# EAGLE design 2015_Amother (EAGLE 6.2)
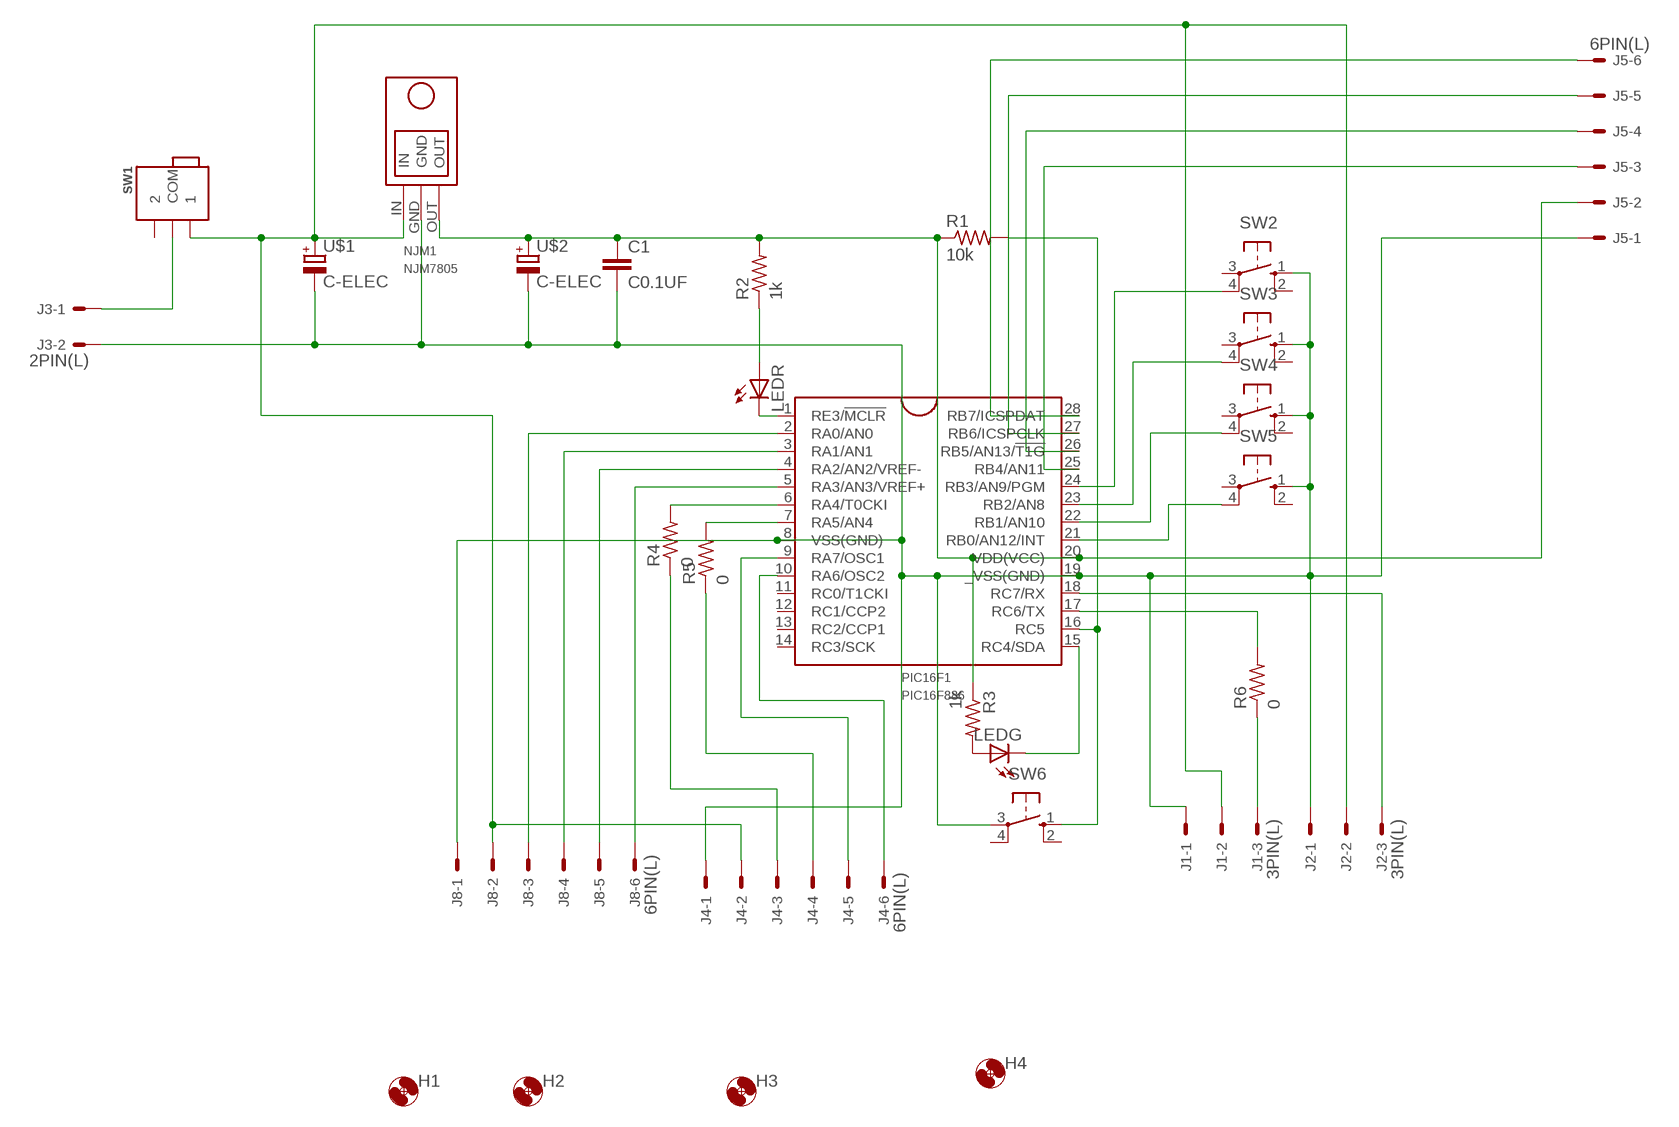
[diagram p0: schematic, sheet 1]

## Parts
C1  C0.1UF  [C0.1UF]
H1  HOLE3.3M3BOLT  [HOLE3.3]
H2  HOLE3.3M3BOLT  [HOLE3.3]
H3  HOLE3.3M3BOLT  [HOLE3.3]
H4  HOLE3.3M3BOLT  [HOLE3.3]
J1  3PIN(L)  [3PL]
J2  3PIN(L)  [3PL]
J3  2PIN(L)  [2PL]
J4  6PIN(L)  [6PL]
J5  6PIN(L)  [6PL]
J8  6PIN(L)  [6PL]
LEDG  LED3MM  [LED3MM]
LEDR  LED3MM  [LED3MM]
NJM1  NJM7805  [NJM7805]
PIC16F1  PIC16F886  [DIL28-3]
R1  10k  R-  [0207/10]
R2  1k  R-  [0207/10]
R3  1k  R-  [0207/10]
R4  0  R-  [0207/10]
R5  0  R-  [0207/10]
R6  0  R-  [0207/10]
SW1  SWITCH_MININORMAL  [SWITCH_MINI]
SW2  TACTSW  [TACT]
SW3  TACTSW  [TACT]
SW4  TACTSW  [TACT]
SW5  TACTSW  [TACT]
SW6  TACTSW  [TACT]
U$1  C-ELEC  [C-6MM]
U$2  C-ELEC  [C-6MM]

## Nets
N$1: J3.1 SW1.COM
N$2: J1.2 J2.2 J4.2 J8.2 NJM1.IN SW1.1 U$1.+
N$3: J4.3 R4.1
N$4: LEDG.A R3.2
N$5: PIC16F1.16(RC5) R1.2 SW6.1(S)
N$6: J1.3 R6.1
N$7: J8.3 PIC16F1.2(RA0/AN0)
N$8: J8.4 PIC16F1.3(RA1/AN1)
N$9: J8.5 PIC16F1.4(RA2/AN2/VREF-)
N$10: J8.6 PIC16F1.5(RA3/AN3/VREF+)
N$11: J4.4 R5.1
N$12: LEDR.A R2.1
N$13: C1.2 J1.1 J2.1 J3.2 J4.1 J5.1 J8.1 NJM1.GND PIC16F1.8(VSS(GND)) PIC16F1.19(_VSS(GND)) SW2.1(S) SW3.1(S) SW4.1(S) SW5.1(S) SW6.3(P) U$1.- U$2.-
N$14: LEDR.K(C) PIC16F1.1(RE3/!MCLR)
N$15: PIC16F1.21(RB0/AN12/INT) SW5.4(P1)
N$16: PIC16F1.22(RB1/AN10) SW4.4(P1)
N$17: J4.5 PIC16F1.9(RA7/OSC1)
N$18: PIC16F1.24(RB3/AN9/PGM) SW2.4(P1)
N$19: J4.6 PIC16F1.10(RA6/OSC2)
N$20: PIC16F1.23(RB2/AN8) SW3.4(P1)
N$21: LEDG.K(C) PIC16F1.15(RC4/SDA)
N$22: J5.3 PIC16F1.25(RB4/AN11)
N$23: C1.1 J5.2 NJM1.OUT PIC16F1.20(VDD(VCC)) R1.1 R2.2 R3.1 U$2.+
N$24: J5.4 PIC16F1.26(RB5/AN13/!T1G)
N$25: PIC16F1.17(RC6/TX) R6.2
N$26: J5.5 PIC16F1.27(RB6/ICSPCLK)
N$27: J5.6 PIC16F1.28(RB7/ICSPDAT)
N$28: PIC16F1.6(RA4/T0CKI) R4.2
N$29: PIC16F1.7(RA5/AN4) R5.2
N$30: J2.3 PIC16F1.18(RC7/RX)
Unconnected: PIC16F1.11(RC0/T1CKI) PIC16F1.12(RC1/CCP2) PIC16F1.13(RC2/CCP1) PIC16F1.14(RC3/SCK) SW1.2 SW2.2(S1) SW2.3(P) SW3.2(S1) SW3.3(P) SW4.2(S1) SW4.3(P) SW5.2(S1) SW5.3(P) SW6.2(S1) SW6.4(P1)

## Library data of the parts
C1 = FP-21T for MITS:C0.1UF
H1-H4 = FP-21T for MITS:HOLE3.3
J1 J2 = my_connector:3PIN(L)
J3 = my_connector:2PIN(L)
J4 J5 J8 = my_connector:6PIN(L)
LEDG LEDR = FP-21T for MITS:LED: LED OSRAM: - CHIPLED LG R971, LG N971, LY N971, LG Q971, LY Q971, LO R971, LY R971 LH N974, LH R974 LS Q976, LO Q976, LY Q976 LO Q996 - Hyper CHIPLED LW Q18S LB Q993, LB Q99A, LB R99A - SideLED LS A670, LO A670, LY A670, LG A670, LP A670 LB A673, LV A673, LT A673, LW A673 LH A674 LY A675 LS A676, LA A676, LO A676, LY A676, LW A676 LS A679, LY A679, LG A679 - Hyper Micro SIDELED® LS Y876, LA Y876, LO Y876, LY Y876 LT Y87S - SmartLED LW L88C, LW L88S LB L89C, LB L89S, LG L890 LS L89K, LO L89K, LY L89K LS L896, LA L896, LO L896, LY L896 - TOPLED LS T670, LO T670, LY T670, LG T670, LP T670 LSG T670, LSP T670, LSY T670, LOP T670, LYG T670 LG T671, LOG T671, LSG T671 LB T673, LV T673, LT T673, LW T673 LH T674 LS T676, LA T676, LO T676, LY T676, LB T676, LH T676, LSB T676, LW T676 LB T67C, LV T67C, LT T67C, LS T67K, LO T67K, LY T67K, LW E67C LS E67B, LA E67B, LO E67B, LY E67B, LB E67C, LV E67C, LT E67C LW T67C LS T679, LY T679, LG T679 LS T770, LO T770, LY T770, LG T770, LP T770 LB T773, LV T773, LT T773, LW T773 LH T774 LS E675, LA E675, LY E675, LS T675 LS T776, LA T776, LO T776, LY T776, LB T776 LHGB T686 LT T68C, LB T68C - Hyper Mini TOPLED® LB M676 - Mini TOPLED Santana® LG M470 LS M47K, LO M47K, LY M47K Source: http://www.osram.convergy.de - LUMILED® LXK2-PW12-R00, LXK2-PW12-S00, LXK2-PW14-U00, LXK2-PW14-V00 LXK2-PM12-R00, LXK2-PM12-S00, LXK2-PM14-U00 LXK2-PE12-Q00, LXK2-PE12-R00, LXK2-PE12-S00, LXK2-PE14-T00, LXK2-PE14-U00 LXK2-PB12-K00, LXK2-PB12-L00, LXK2-PB12-M00, LXK2-PB14-N00, LXK2-PB14-P00, LXK2-PB14-Q00 LXK2-PR12-L00, LXK2-PR12-M00, LXK2-PR14-Q00, LXK2-PR14-R00 LXK2-PD12-Q00, LXK2-PD12-R00, LXK2-PD12-S00 LXK2-PH12-R00, LXK2-PH12-S00 LXK2-PL12-P00, LXK2-PL12-Q00, LXK2-PL12-R00 Source: www.luxeon.com
NJM1 = My_NJM7805:NJM7805
PIC16F1 = FixLib:PIC16F886
R1-R6 = My_rcl:R-: Resistor
SW1 = FP-21T for MITS:SWITCH_MINI: Switch 5.08mm
SW2-SW6 = pushsw:TACTSW
U$1 U$2 = My_rcl:C-ELEC

## Board
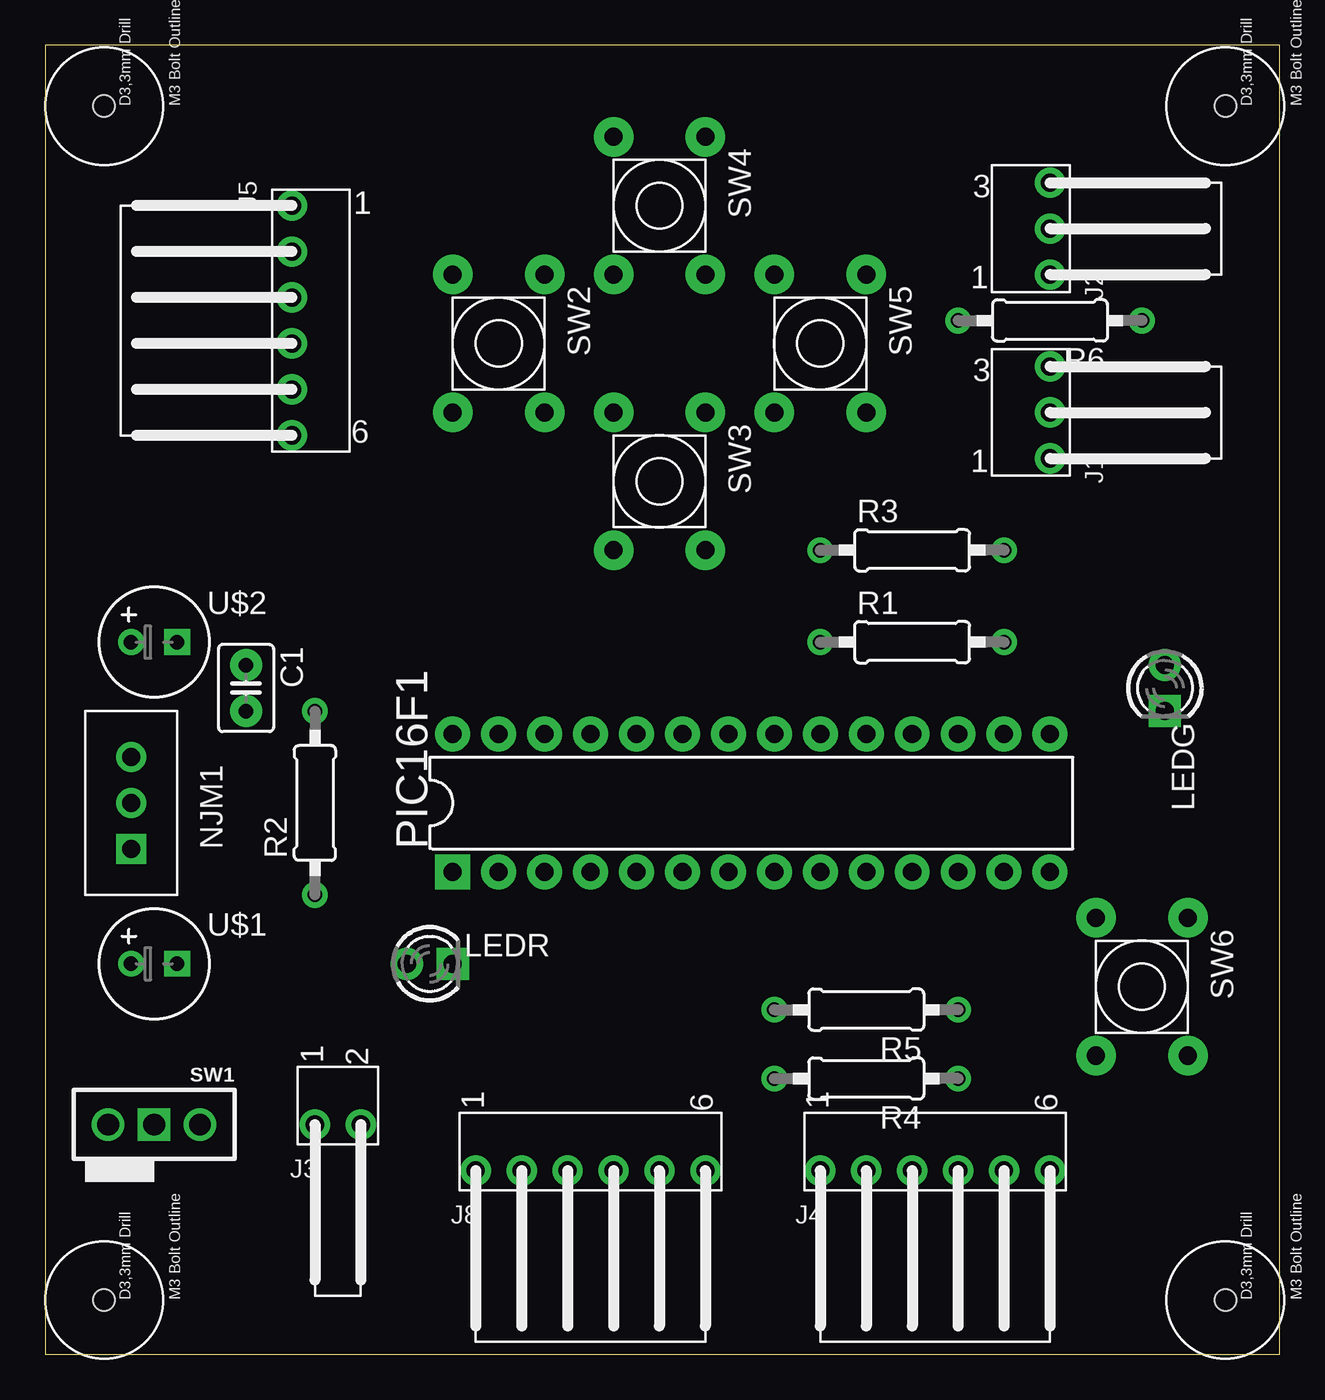
[diagram p1: board, top side]
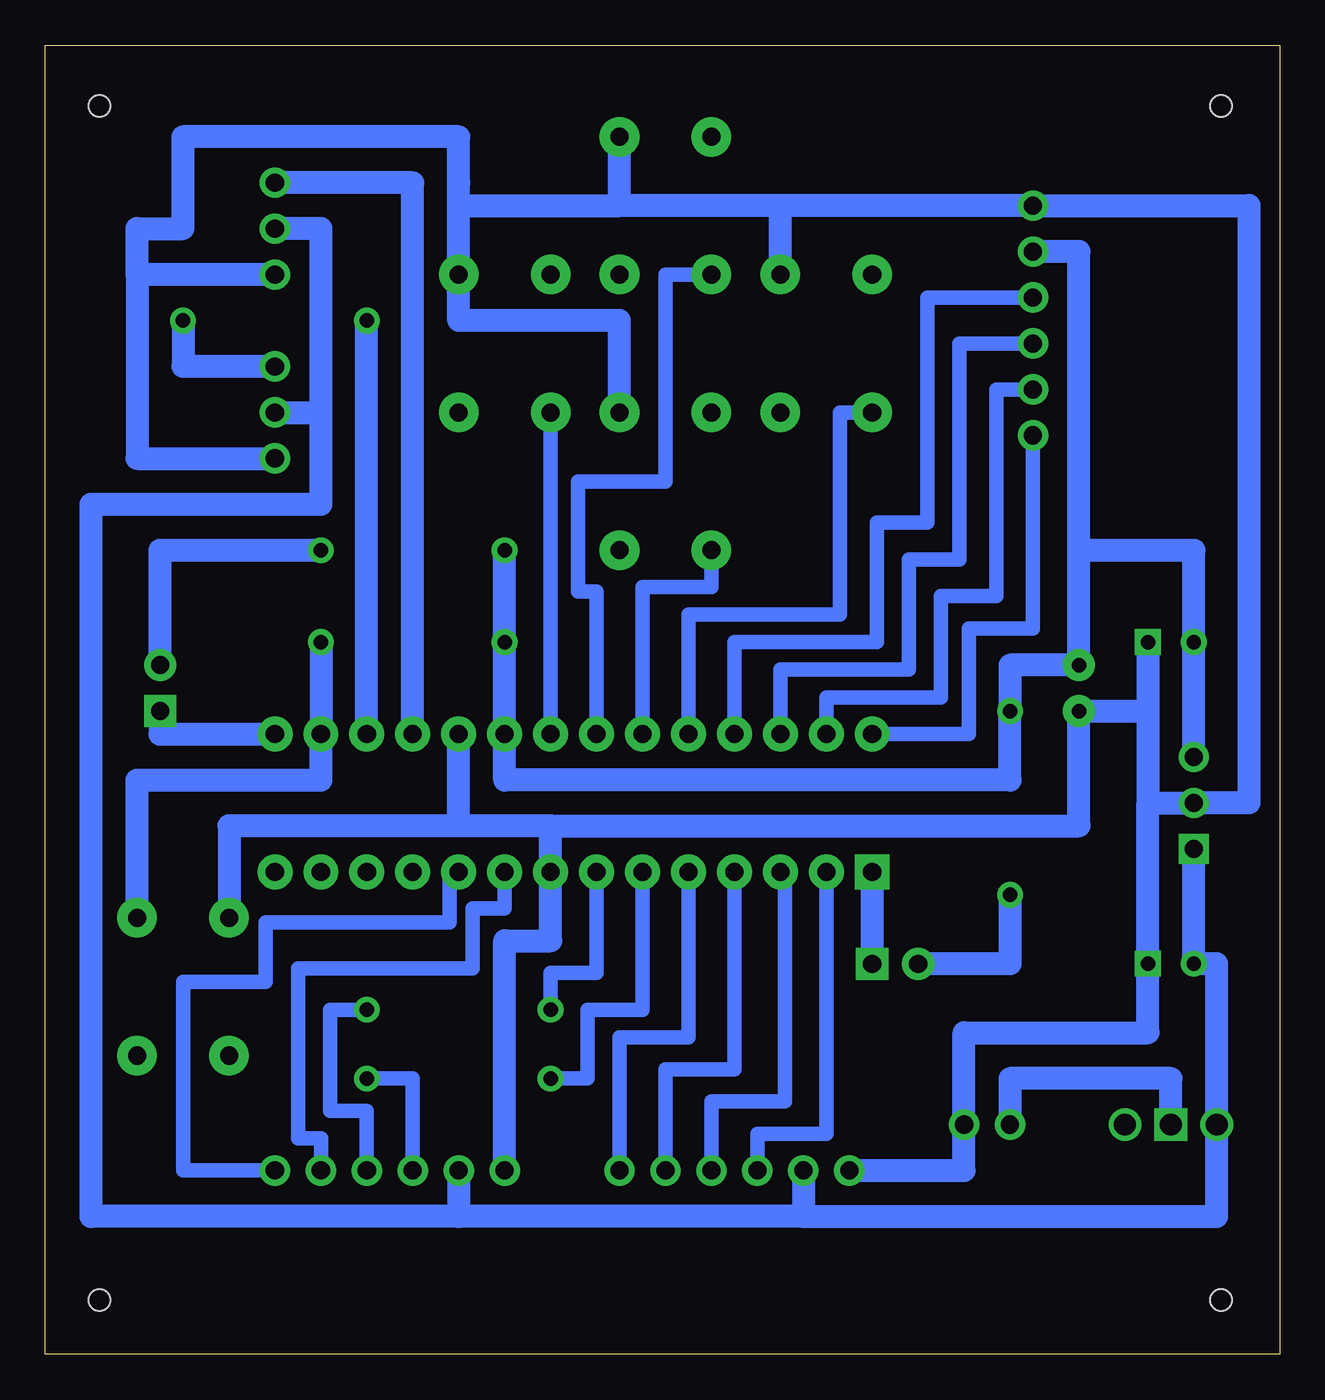
[diagram p2: board, bottom side, seen from below]

Size 68.25 x 72.37 mm. Coordinates in mm from the lower left corner, seen from the top.
Outline: 68.25,0 68.25,72.37 0,72.37 0,0 68.25,0
Copper layers (1*16): Top 0.035mm / dielectric 1.5mm / Bottom 0.035mm
Design rules: minimum track width 0.15mm, minimum drill 0.3mm, track to track 0.15mm, track to pad 0.15mm, pad to pad 0.15mm, via to via 0.15mm, smd to smd 0.15mm, copper to edge 0.7mm, drill to drill 0.45mm, minimum pad ring 0.15mm, minimum via ring 0.15mm, stop-mask expansion 4mil, vias tented up to drill 0mil, thermal gap 0.15mm

### Footprints (pad centres in the part's own frame; a part is rotated, then mirrored left to right if it is on the bottom)
C0.1UF = drill 0.8 pad 1.778: 1 -1.27,0; 2 1.27,0
HOLE3.3 = hole 1.2: 0,0
3PL = drill 1 pad 1.676: 1 2.54,3.81; 2 0,3.81; 3 -2.54,3.81
2PL = drill 1 pad 1.676: 1 1.27,3.81; 2 -1.27,3.81
6PL = drill 1 pad 1.676: 1 6.35,3.81; 2 3.81,3.81; 3 1.27,3.81; 4 -1.27,3.81; 5 -3.81,3.81; 6 -6.35,3.81
LED3MM = drill 1 pad 1.778: A -1.27,0 | drill 1 pad 1.778 square: K 1.27,0
NJM7805 = drill 1 pad 1.676: GND 0,0; OUT 2.54,0 | drill 1 pad 1.676 square: IN -2.54,0
DIL28-3 = drill 1 pad 1.93 square: 1 -16.51,-3.81 | drill 1 pad 1.93: 2 -13.97,-3.81; 3 -11.43,-3.81; 4 -8.89,-3.81; 5 -6.35,-3.81; 6 -3.81,-3.81; 7 -1.27,-3.81; 8 1.27,-3.81; 9 3.81,-3.81; 10 6.35,-3.81; 11 8.89,-3.81; 12 11.43,-3.81; 13 13.97,-3.81; 14 16.51,-3.81; 15 16.51,3.81; 16 13.97,3.81; 17 11.43,3.81; 18 8.89,3.81; 19 6.35,3.81; 20 3.81,3.81; 21 1.27,3.81; 22 -1.27,3.81; 23 -3.81,3.81; 24 -6.35,3.81; 25 -8.89,3.81; 26 -11.43,3.81; 27 -13.97,3.81; 28 -16.51,3.81
0207/10 = drill 0.8 pad 1.422: 1 -5.08,0; 2 5.08,0
SWITCH_MINI = drill 1.2 pad 1.8: 1 0,2.54; 2 0,-2.54 | drill 1.2 pad 1.8 square: COM 0,0
TACT = drill 1 pad 2.184: 1 -3.81,2.54; 2 3.81,2.54; 3 -3.81,-2.54; 4 3.81,-2.54
C-6MM = drill 0.8 pad 1.422: + -1.27,0 | drill 0.8 pad 1.422 square: - 1.27,0

### Placement (x,y rotation side)
C1  11.1,36.83 270 top
H1  65.25,3 90 top
H2  65.25,69 90 top
H3  3.25,3 90 top
H4  3.25,69 90 top
J1  51.74,52.07 270 top
J2  51.74,62.23 270 top
J3  16.18,16.51 180 top
J4  49.2,13.97 180 top
J5  17.45,57.15 90 top
J8  30.15,13.97 180 top
LEDG  61.9,36.83 270 top
LEDR  21.26,21.59 0 top
NJM1  4.75,30.48 90 top
PIC16F1  39.04,30.48 0 top
R1  47.93,39.37 0 top
R2  14.91,30.48 90 top
R3  47.93,44.45 0 top
R4  45.39,15.24 180 top
R5  45.39,19.05 180 top
R6  55.55,57.15 180 top
SW1  6.02,12.7 90 top
SW2  25.07,55.88 270 top
SW3  33.96,48.26 270 top
SW4  33.96,63.5 270 top
SW5  42.85,55.88 270 top
SW6  60.63,20.32 270 top
U$1  6.02,21.59 0 top
U$2  6.02,39.37 0 top

### Tracks (layer width: path | path; a pad name or v marks a point on that pad's centre or on a via)
N$1
  Bottom 1.27: SW1.COM 6.02,15.24 14.91,15.24 J3.1
N$2
  Bottom 1.27: 26.34,7.62 3.48,7.62 SW1.1 3.48,21.59 U$1.+ NJM1.IN | 53.01,52.07 53.01,46.99 65.71,46.99 65.71,7.62 45.39,7.62 | 53.01,52.07 53.01,62.23 J2.2 | J8.2 26.34,7.62 | 26.34,7.62 45.39,7.62 | J4.2 45.39,7.62 | J1.2 53.01,52.07
N$3
  Bottom 0.813: R4.1 47.93,15.24 J4.3
N$4
  Bottom 1.27: LEDG.A 61.9,44.45 R3.2
N$5
  Bottom 1.27: SW6.1 63.17,31.75 53.01,31.75 PIC16F1.16 R1.2
N$6
  Bottom 1.27: J1.3 60.63,54.61 R6.1
N$7
  Bottom 0.813: J8.3 28.88,12.19 25.07,12.19 PIC16F1.2
N$8
  Bottom 0.813: J8.4 31.42,13.97 27.36,13.97 27.36,26.67 PIC16F1.3
N$9
  Bottom 0.813: J8.5 33.96,15.75 30.15,15.75 PIC16F1.4
N$10
  Bottom 0.813: PIC16F1.5 32.69,17.53 36.5,17.53 J8.6
N$11
  Bottom 0.813: J4.4 50.47,13.46 52.5,13.46 52.5,19.05 R5.1
N$12
  Bottom 1.27: R2.1 14.91,21.59 LEDR.A
N$13
  Bottom 1.27: 7.29,30.48 U$1.- 7.29,17.78 17.45,17.78 J3.2 17.45,10.16 J8.1 | 7.29,30.48 NJM1.GND 1.7,30.48 1.7,63.5 J5.1 27.61,63.5 | U$2.- 7.29,35.56 | 7.29,35.56 7.29,30.48 | 40.31,29.21 45.39,29.21 | 45.39,29.21 PIC16F1.19 | 40.31,29.21 PIC16F1.8 40.31,22.86 42.85,22.86 J4.1 | 40.31,29.21 11.1,29.21 C1.2 7.29,35.56 | SW2.1 27.61,63.5 | 27.61,63.5 36.5,63.5 | 36.5,63.5 SW4.1 | SW5.1 45.39,63.5 | 45.39,63.5 36.5,63.5 | SW3.1 36.5,57.15 45.39,57.15 SW5.1 | 45.39,63.5 45.39,64.77 | SW5.1 45.39,67.31 60.63,67.31 60.63,62.23 63.17,62.23 63.17,59.69 | J2.1 63.17,59.69 | 63.17,59.69 63.17,49.53 J1.1 | 45.39,29.21 58.09,29.21 SW6.3
N$14
  Bottom 1.27: LEDR.K PIC16F1.1
N$15
  Bottom 0.813: PIC16F1.21 SW5.4
N$16
  Bottom 0.813: PIC16F1.22 37.77,42.16 38.79,42.16 38.79,48.26 33.96,48.26 33.96,59.69 SW4.4
N$17
  Bottom 0.813: J4.5 53.01,11.94 54.28,11.94 54.28,21.34 44.63,21.34 44.63,24.64 42.85,24.64 PIC16F1.9
N$18
  Bottom 0.813: PIC16F1.24 32.69,40.89 24.31,40.89 24.31,52.07 SW2.4
N$19
  Bottom 0.813: PIC16F1.10 45.9,26.67 45.9,23.88 56.06,23.88 56.06,20.57 60.63,20.57 60.63,10.16 J4.6
N$20
  Bottom 0.813: PIC16F1.23 35.23,42.42 31.42,42.42 SW3.4
N$21
  Bottom 1.27: LEDG.K 61.9,34.29 PIC16F1.15
N$22
  Bottom 0.813: J5.3 19.48,58.42 19.48,45.97 22.28,45.97 22.28,39.37 30.15,39.37 PIC16F1.25
N$23
  Bottom 1.27: NJM1.OUT U$2.+ 4.75,44.45 11.1,44.45 | 11.1,44.45 C1.1 14.91,38.1 R2.2 14.91,31.75 42.85,31.75 PIC16F1.20 R1.1 R3.1 | 11.1,44.45 11.1,60.96 J5.2
N$24
  Bottom 0.813: J5.4 17.7,55.88 17.7,43.94 20.5,43.94 20.5,37.85 27.61,37.85 PIC16F1.26
N$25
  Bottom 1.27: PIC16F1.17 R6.2
N$26
  Bottom 0.813: J5.5 15.67,53.34 15.67,41.91 18.72,41.91 18.72,36.32 25.07,36.32 PIC16F1.27
N$27
  Bottom 0.813: J5.6 13.64,40.13 17.2,40.13 17.2,34.29 PIC16F1.28
N$28
  Bottom 0.813: R4.2 38.28,15.24 38.28,19.05 35.23,19.05 PIC16F1.6
N$29
  Bottom 0.813: R5.2 40.31,21.08 37.77,21.08 PIC16F1.7
N$30
  Bottom 1.27: PIC16F1.18 47.93,64.77 J2.3